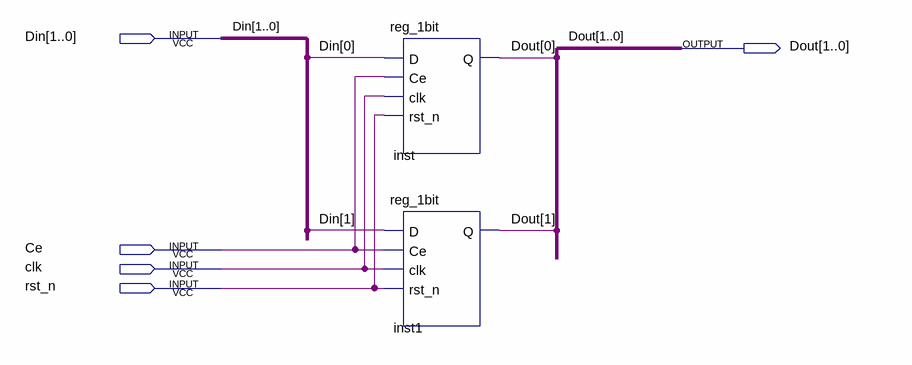
[diagram p0: schematic sheet]
// Quartus schematic reg_2bit.bdf as structural Verilog: 2 symbols, 5 pins
module reg_2bit (
  input  [1:0] Din,
  input  Ce,
  input  clk,
  input  rst_n,
  output [1:0] Dout
);

  reg_1bit inst (.D(Din[0]), .Ce(Ce), .clk(clk), .rst_n(rst_n), .Q(Dout[0]));
  reg_1bit inst1 (.D(Din[1]), .Ce(Ce), .clk(clk), .rst_n(rst_n), .Q(Dout[1]));
endmodule
